# Altium schematic sheet IC - Clock, Timing, Oscillator.SchDoc
size A4; SheetNumber: 27; SheetTotal: 34
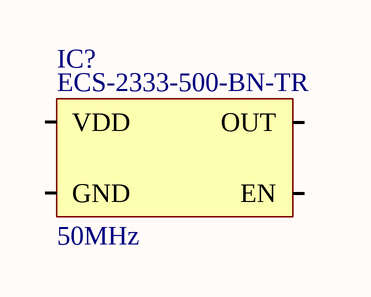
[diagram p0: IC - Clock, Timing, Oscillator.SchDoc]

## Parts
IC?  Frequency: 50MHz  Manufacturer Part Number: ECS-2333-500-BN-TR  [Clock Oscillator - ECS, ECS-2325, ECS-2333]  (hidden comment: Clock Oscillator - ECS, ECS-2325, ECS-2333)

## Nets

Not connected (* = marked no-connect by the designer): IC? EN GND OUT VDD

## Library data of the parts
IC? = Clock Oscillator - ECS, ECS-2325, ECS-2333: IC, Oscillator, 50MHz; ComponentLink1Description: Datasheet; ComponentLink1URL: E:\Altium\Datasheets\IC - Clock, Timing, Oscillator\Clock Oscillator - ECS, ECS-2325, ECS-2333.pdf; ComponentLink2Description: Supplier Link; ComponentLink2URL: https://www.digikey.com/en/products/detail/ecs-inc/ECS-2333-500-BN-TR/3927356; Supplier: Digikey; Supplier Part Number: XC1930CT-ND; Operating Temperature, Min: -40℃; Operating Temperature, Max: +85℃; Quantity, Min: 1; Quantity, Max: 10000; Price, Min: 1.24; Supplier Currency: $; Price, Max: 0.71656; Supplier Link: https://www.digikey.com/en/products/detail/ecs-inc/ECS-2333-500-BN-TR/3927356; Component Type: Clock, Timing, Oscillator; Component Category: IC; Manufacturer: ECS; Package: Flat, 3.2mm x 2.5mm